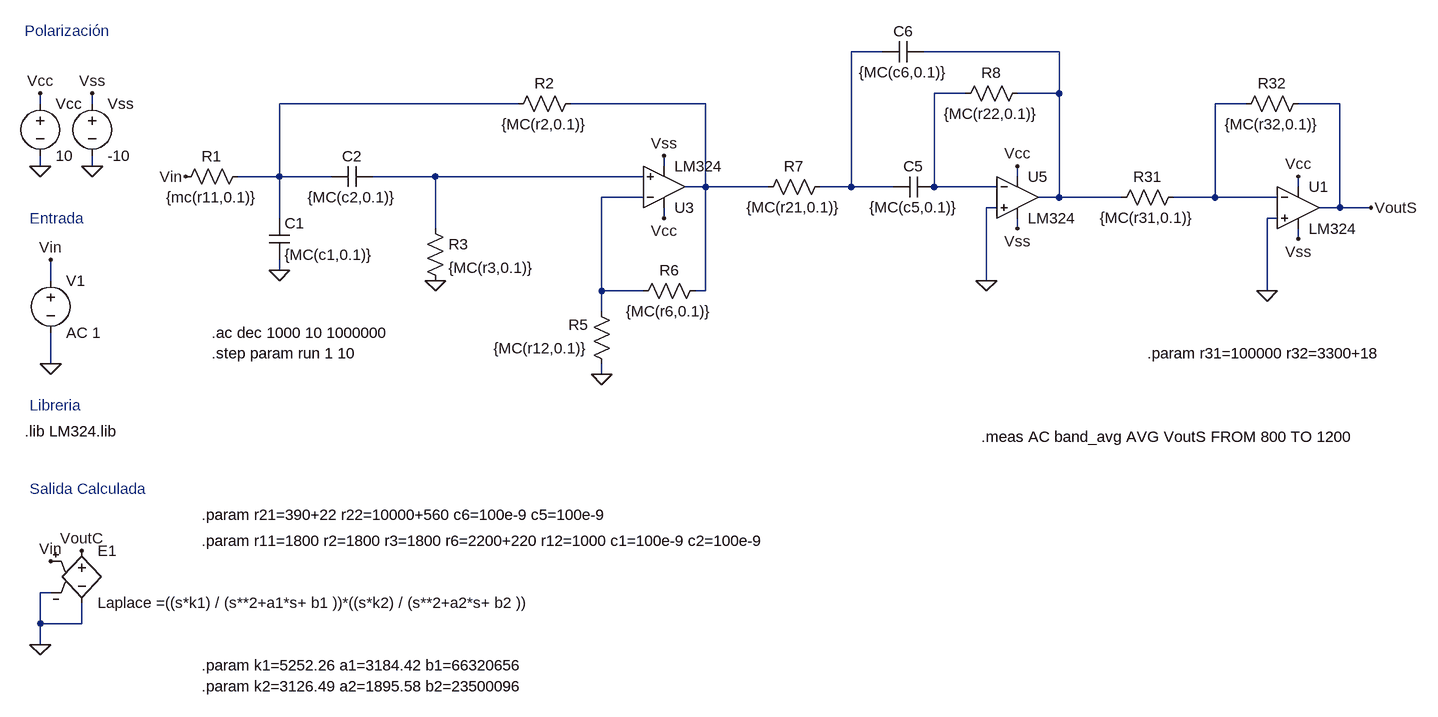
[diagram p0: schematic TP4_CombinacionFinal.asc]
TP4_CombinacionFinal.asc, the LTspice schematic file:
Version 4
SHEET 1 2240 1040
WIRE 1280 48 1232 48
WIRE 1552 48 1344 48
WIRE 1408 112 1360 112
WIRE 1552 112 1552 48
WIRE 1552 112 1488 112
WIRE -16 128 -16 112
WIRE 64 128 64 112
WIRE 720 128 352 128
WIRE 1008 128 800 128
WIRE 1840 128 1792 128
WIRE 1984 128 1920 128
WIRE -16 224 -16 208
WIRE 64 224 64 208
WIRE 944 224 944 208
WIRE 352 240 352 128
WIRE 352 240 288 240
WIRE 432 240 352 240
WIRE 592 240 496 240
WIRE 912 240 592 240
WIRE 1488 240 1488 224
WIRE 1008 256 1008 128
WIRE 1008 256 976 256
WIRE 1104 256 1008 256
WIRE 1232 256 1232 48
WIRE 1232 256 1184 256
WIRE 1296 256 1232 256
WIRE 1360 256 1360 112
WIRE 1456 256 1360 256
WIRE 1920 256 1920 240
WIRE 912 272 848 272
WIRE 1552 272 1552 112
WIRE 1552 272 1520 272
WIRE 1648 272 1552 272
WIRE 1792 272 1792 128
WIRE 1792 272 1728 272
WIRE 1888 272 1792 272
WIRE 1456 288 1440 288
WIRE 1984 288 1984 128
WIRE 1984 288 1952 288
WIRE 2032 288 1984 288
WIRE 352 304 352 240
WIRE 944 304 944 288
WIRE 1888 304 1872 304
WIRE 592 320 592 240
WIRE 1488 320 1488 304
WIRE 1920 336 1920 320
WIRE 352 384 352 368
WIRE 0 400 0 368
WIRE 1440 400 1440 288
WIRE 848 416 848 272
WIRE 912 416 848 416
WIRE 1008 416 1008 256
WIRE 1008 416 992 416
WIRE 1872 416 1872 304
WIRE 848 448 848 416
WIRE 0 528 0 480
WIRE 848 544 848 528
WIRE 0 880 -16 880
WIRE -16 928 -16 880
WIRE 48 928 48 896
WIRE 48 928 -16 928
WIRE -16 960 -16 928
FLAG -16 224 0
FLAG 64 224 0
FLAG 352 384 0
FLAG 0 528 0
FLAG 592 400 0
FLAG 848 544 0
FLAG 1440 400 0
FLAG 0 368 Vin
FLAG 208 240 Vin
FLAG 0 832 Vin
FLAG -16 960 0
FLAG 48 816 VoutC
FLAG -16 112 Vcc
FLAG 64 112 Vss
FLAG 1488 320 Vss
FLAG 944 208 Vss
FLAG 944 304 Vcc
FLAG 1488 224 Vcc
FLAG 1872 416 0
FLAG 2032 288 VoutS
FLAG 1920 336 Vss
FLAG 1920 240 Vcc
SYMBOL voltage -16 112 R0
SYMATTR InstName Vcc
SYMATTR Value 10
SYMBOL voltage 64 112 R0
SYMATTR InstName Vss
SYMATTR Value -10
SYMBOL res 304 224 R90
WINDOW 0 0 56 VBottom 2
WINDOW 3 32 56 VTop 2
SYMATTR InstName R1
SYMATTR Value {mc(r11,0.1)}
SYMBOL res 576 304 R0
SYMATTR InstName R3
SYMATTR Value {MC(r3,0.1)}
SYMBOL res 816 112 R90
WINDOW 0 0 56 VBottom 2
WINDOW 3 32 56 VTop 2
SYMATTR InstName R2
SYMATTR Value {MC(r2,0.1)}
SYMBOL cap 496 224 R90
WINDOW 0 0 32 VBottom 2
WINDOW 3 32 32 VTop 2
SYMATTR InstName C2
SYMATTR Value {MC(c2,0.1)}
SYMBOL voltage 0 384 R0
SYMATTR InstName V1
SYMATTR Value AC 1
SYMBOL res 1008 400 R90
WINDOW 0 0 56 VBottom 2
WINDOW 3 32 56 VTop 2
SYMATTR InstName R6
SYMATTR Value {MC(r6,0.1)}
SYMBOL res 864 544 R180
WINDOW 0 36 76 Left 2
WINDOW 3 36 40 Left 2
SYMATTR InstName R5
SYMATTR Value {MC(r12,0.1)}
SYMBOL cap 1344 32 R90
WINDOW 0 0 32 VBottom 2
WINDOW 3 32 32 VTop 2
SYMATTR InstName C6
SYMATTR Value {MC(c6,0.1)}
SYMBOL res 1504 96 R90
WINDOW 0 0 56 VBottom 2
WINDOW 3 32 56 VTop 2
SYMATTR InstName R8
SYMATTR Value {MC(r22,0.1)}
SYMBOL cap 1360 240 R90
WINDOW 0 0 32 VBottom 2
WINDOW 3 32 32 VTop 2
SYMATTR InstName C5
SYMATTR Value {MC(c5,0.1)}
SYMBOL res 1200 240 R90
WINDOW 0 0 56 VBottom 2
WINDOW 3 32 56 VTop 2
SYMATTR InstName R7
SYMATTR Value {MC(r21,0.1)}
SYMBOL cap 336 304 R0
SYMATTR InstName C1
SYMATTR Value {MC(c1,0.1)}
SYMBOL e 48 800 R0
SYMATTR InstName E1
SYMATTR Value Laplace =((s*k1) / (s**2+a1*s+ b1 ))*((s*k2) / (s**2+a2*s+ b2 ))
SYMBOL OpAmps\\opamp2 1488 208 R0
SYMATTR InstName U5
SYMATTR Value LM324
SYMBOL OpAmps\\opamp2 944 320 M180
SYMATTR InstName U3
SYMATTR Value LM324
SYMBOL OpAmps\\opamp2 1920 224 R0
SYMATTR InstName U1
SYMATTR Value LM324
SYMBOL res 1936 112 R90
WINDOW 0 0 56 VBottom 2
WINDOW 3 32 56 VTop 2
SYMATTR InstName R32
SYMATTR Value {MC(r32,0.1)}
SYMBOL res 1744 256 R90
WINDOW 0 0 56 VBottom 2
WINDOW 3 32 56 VTop 2
SYMATTR InstName R31
SYMATTR Value {MC(r31,0.1)}
TEXT 248 480 Left 2 !.ac dec 1000 10 1000000
TEXT 248 512 Left 2 !.step param run 1 10
TEXT -40 632 Left 2 !.lib LM324.lib
TEXT -32 304 Left 2 ;Entrada
TEXT -40 16 Left 2 ;Polarización
TEXT 232 1024 Left 2 !.param k2=3126.49 a2=1895.58 b2=23500096
TEXT 232 992 Left 2 !.param k1=5252.26 a1=3184.42 b1=66320656
TEXT -32 592 Left 2 ;Libreria
TEXT -32 720 Left 2 ;Salida Calculada
TEXT 232 760 Left 2 !.param r21=390+22 r22=10000+560 c6=100e-9 c5=100e-9
TEXT 232 800 Left 2 !.param r11=1800 r2=1800 r3=1800 r6=2200+220 r12=1000 c1=100e-9 c2=100e-9
TEXT 1688 512 Left 2 !.param r31=100000 r32=3300+18
TEXT 1432 640 Left 2 !.meas AC band_avg AVG VoutS FROM 800 TO 1200

The netlist it stands for:
* TP4_CombinacionFinal.asc
Vcc Vcc 0 10
Vss Vss 0 -10
R1 N004 Vin {mc(r11,0.1)}
R3 N007 0 {MC(r3,0.1)}
R2 N005 N004 {MC(r2,0.1)}
C2 N007 N004 {MC(c2,0.1)}
V1 Vin 0 AC 1
R6 N005 N008 {MC(r6,0.1)}
R5 0 N008 {MC(r12,0.1)}
C6 N002 N001 {MC(c6,0.1)}
R8 N002 N003 {MC(r22,0.1)}
C5 N003 N001 {MC(c5,0.1)}
R7 N001 N005 {MC(r21,0.1)}
C1 N004 0 {MC(c1,0.1)}
E1 VoutC 0 Vin 0 Laplace =((s*k1) / (s**2+a1*s+ b1 ))*((s*k2) / (s**2+a2*s+ b2 ))
XU5 0 N003 Vcc Vss N002 LM324  ; pins In+ In- V+ V- OUT
XU3 N007 N008 Vcc Vss N005 LM324  ; pins In+ In- V+ V- OUT
XU1 0 N006 Vcc Vss VoutS LM324  ; pins In+ In- V+ V- OUT
R32 VoutS N006 {MC(r32,0.1)}
R31 N006 N002 {MC(r31,0.1)}
.ac dec 1000 10 1000000
.step param run 1 10
.lib LM324.lib
* Entrada
* Polarización
.param k2=3126.49 a2=1895.58 b2=23500096
.param k1=5252.26 a1=3184.42 b1=66320656
* Libreria
* Salida Calculada
.param r21=390+22 r22=10000+560 c6=100e-9 c5=100e-9
.param r11=1800 r2=1800 r3=1800 r6=2200+220 r12=1000 c1=100e-9 c2=100e-9
.param r31=100000 r32=3300+18
.meas AC band_avg AVG VoutS FROM 800 TO 1200
.backanno
.end